# Altium schematic sheet top.schdoc: MWH618
size A4; Date: 10.01.2026; CheckedBy: BCY; DrawnBy: miaow; Revision: v1.0.0; SheetNumber: 2; SheetTotal: 17; BoardType: MAIN_PCB; Desc: the top level sch
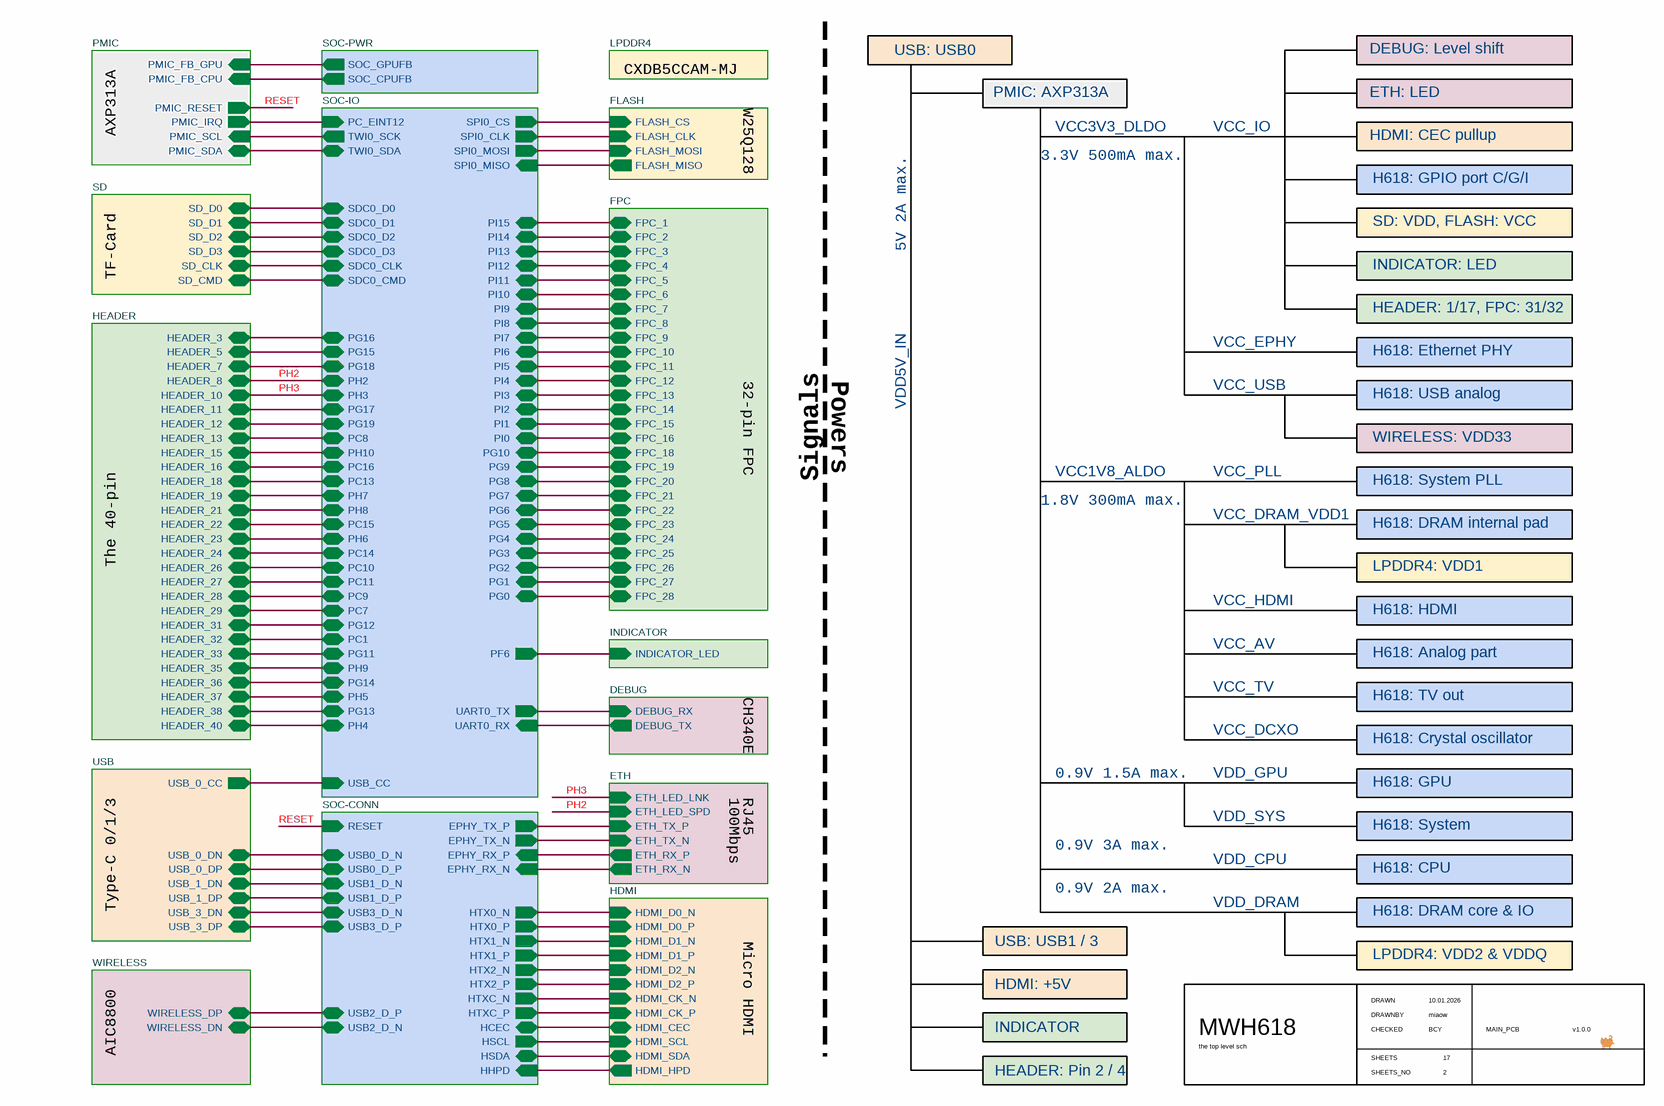
[diagram p0: top.schdoc]

## Sub-sheets
DEBUG = debug.schdoc: DEBUG_TX (out), DEBUG_RX (in)
ETH = eth.schdoc: ETH_TX_P (in), ETH_TX_N (in), ETH_RX_N (out), ETH_RX_P (out), ETH_LED_SPD (in), ETH_LED_LNK (in)
FLASH = flash.schdoc: FLASH_CS (in), FLASH_MISO (out), FLASH_MOSI (in), FLASH_CLK (in)
FPC = fpc.schdoc: FPC_4 (bidir), FPC_5 (bidir), FPC_6 (bidir), FPC_7 (bidir), FPC_8 (bidir), FPC_9 (bidir), FPC_10 (bidir), FPC_11 (bidir), FPC_12 (bidir), FPC_13 (bidir), FPC_14 (bidir), FPC_15 (bidir), FPC_16 (bidir), FPC_22 (bidir), FPC_23 (bidir), FPC_24 (bidir), FPC_25 (bidir), FPC_26 (bidir), FPC_27 (bidir), FPC_28 (bidir), FPC_1 (bidir), FPC_3 (bidir), FPC_2 (bidir), FPC_18 (bidir), FPC_19 (bidir), FPC_20 (bidir), FPC_21 (bidir)
HDMI = hdmi.schdoc: HDMI_D0_N (in), HDMI_D0_P (in), HDMI_D1_N (in), HDMI_D1_P (in), HDMI_D2_N (in), HDMI_D2_P (in), HDMI_CEC (bidir), HDMI_SCL (in), HDMI_SDA (bidir), HDMI_HPD (out), HDMI_CK_N (in), HDMI_CK_P (in)
HEADER = header.schdoc: HEADER_3 (bidir), HEADER_5 (bidir), HEADER_7 (bidir), HEADER_8 (bidir), HEADER_10 (bidir), HEADER_11 (bidir), HEADER_12 (bidir), HEADER_13 (bidir), HEADER_15 (bidir), HEADER_16 (bidir), HEADER_18 (bidir), HEADER_19 (bidir), HEADER_21 (bidir), HEADER_22 (bidir), HEADER_23 (bidir), HEADER_24 (bidir), HEADER_26 (bidir), HEADER_27 (bidir), HEADER_28 (bidir), HEADER_29 (bidir), HEADER_31 (bidir), HEADER_32 (bidir), HEADER_33 (bidir), HEADER_35 (bidir), HEADER_36 (bidir), HEADER_37 (bidir), HEADER_38 (bidir), HEADER_40 (bidir)
INDICATOR = indicator.schdoc: INDICATOR_LED (in)
LPDDR4 = dram.schdoc: no entries
PMIC = pmic.schdoc: PMIC_FB_GPU (in), PMIC_FB_CPU (in), PMIC_SDA (bidir), PMIC_SCL (in), PMIC_IRQ (out), PMIC_RESET (out)
SD = sd.schdoc: SD_D0 (bidir), SD_D1 (bidir), SD_CLK (bidir), SD_D2 (bidir), SD_D3 (bidir), SD_CMD (bidir)
SOC-CONN = soc-conn.schdoc: HHPD (in), HSDA (bidir), HSCL (out), HCEC (bidir), HTXC_P (out), HTXC_N (out), HTX2_P (out), HTX2_N (out), HTX1_P (out), HTX1_N (out), HTX0_P (out), HTX0_N (out), EPHY_RX_N (in), EPHY_RX_P (in), EPHY_TX_N (out), EPHY_TX_P (out), USB2_D_P (bidir), USB2_D_N (bidir), USB3_D_P (bidir), USB3_D_N (bidir), USB1_D_P (bidir), USB1_D_N (bidir), USB0_D_P (bidir), USB0_D_N (bidir), RESET (in)
SOC-IO = soc-io.schdoc: UART0_RX (in), UART0_TX (out), PC_EINT12 (in), TWI0_SDA (bidir), TWI0_SCK (out), SDC0_D1 (bidir), SDC0_D2 (bidir), SDC0_D0 (bidir), SDC0_D3 (bidir), SDC0_CLK (bidir), SDC0_CMD (bidir), PG16 (bidir), PG15 (bidir), PG18 (bidir), PG17 (bidir), PG19 (bidir), PC8 (bidir), PH10 (bidir), PC16 (bidir), PC13 (bidir), PH7 (bidir), PH8 (bidir), PC15 (bidir), PH6 (bidir), PC14 (bidir), PC10 (bidir), PC11 (bidir), PC9 (bidir), PC7 (bidir), PG12 (bidir), USB_CC (in), PF6 (out), PC1 (bidir), PG11 (bidir), PH9 (bidir), PG14 (bidir), PH5 (bidir), PG13 (bidir), PH4 (bidir), SPI0_CS (out), SPI0_CLK (out), SPI0_MOSI (out), SPI0_MISO (in), PI15 (bidir), PI14 (bidir), PI13 (bidir), PI12 (bidir), PI11 (bidir), PI10 (bidir), PI9 (bidir), PI8 (bidir), PI7 (bidir), PI6 (bidir), PI4 (bidir), PI5 (bidir), PI3 (bidir), PI2 (bidir), PI1 (bidir), PI0 (bidir), PG10 (bidir), PG9 (bidir), PG8 (bidir), PG7 (bidir), PG6 (bidir), PG5 (bidir), PG4 (bidir), PG0 (bidir), PG3 (bidir), PG2 (bidir), PG1 (bidir), PH2 (bidir), PH3 (bidir)
SOC-PWR = soc-pwr.schdoc: SOC_GPUFB (out), SOC_CPUFB (out)
USB = usb.schdoc: USB_0_DN (bidir), USB_0_DP (bidir), USB_1_DN (bidir), USB_1_DP (bidir), USB_3_DN (bidir), USB_3_DP (bidir), USB_0_CC (out)
WIRELESS = wireless.schdoc: WIRELESS_DN (bidir), WIRELESS_DP (bidir)

## Nets
PH2: sheet SOC-IO/PH2, sheet ETH/ETH_LED_SPD, sheet HEADER/HEADER_8
PH3: sheet SOC-IO/PH3, sheet ETH/ETH_LED_LNK, sheet HEADER/HEADER_10
RESET: sheet PMIC/PMIC_RESET, sheet SOC-CONN/RESET
(unnamed): sheet HDMI/HDMI_D0_N, sheet SOC-CONN/HTX0_N
(unnamed): sheet HDMI/HDMI_D0_P, sheet SOC-CONN/HTX0_P
(unnamed): sheet HDMI/HDMI_D1_N, sheet SOC-CONN/HTX1_N
(unnamed): sheet HDMI/HDMI_D1_P, sheet SOC-CONN/HTX1_P
(unnamed): sheet HDMI/HDMI_D2_N, sheet SOC-CONN/HTX2_N
(unnamed): sheet HDMI/HDMI_D2_P, sheet SOC-CONN/HTX2_P
(unnamed): sheet HDMI/HDMI_CEC, sheet SOC-CONN/HCEC
(unnamed): sheet HDMI/HDMI_SCL, sheet SOC-CONN/HSCL
(unnamed): sheet HDMI/HDMI_SDA, sheet SOC-CONN/HSDA
(unnamed): sheet HDMI/HDMI_HPD, sheet SOC-CONN/HHPD
(unnamed): sheet HDMI/HDMI_CK_N, sheet SOC-CONN/HTXC_N
(unnamed): sheet HDMI/HDMI_CK_P, sheet SOC-CONN/HTXC_P
(unnamed): sheet PMIC/PMIC_FB_GPU, sheet SOC-PWR/SOC_GPUFB
(unnamed): sheet PMIC/PMIC_FB_CPU, sheet SOC-PWR/SOC_CPUFB
(unnamed): sheet PMIC/PMIC_SDA, sheet SOC-IO/TWI0_SDA
(unnamed): sheet PMIC/PMIC_SCL, sheet SOC-IO/TWI0_SCK
(unnamed): sheet PMIC/PMIC_IRQ, sheet SOC-IO/PC_EINT12
(unnamed): sheet SOC-CONN/EPHY_RX_N, sheet ETH/ETH_RX_N
(unnamed): sheet SOC-CONN/EPHY_RX_P, sheet ETH/ETH_RX_P
(unnamed): sheet SOC-CONN/EPHY_TX_N, sheet ETH/ETH_TX_N
(unnamed): sheet SOC-CONN/EPHY_TX_P, sheet ETH/ETH_TX_P
(unnamed): sheet SOC-CONN/USB2_D_P, sheet WIRELESS/WIRELESS_DP
(unnamed): sheet SOC-CONN/USB2_D_N, sheet WIRELESS/WIRELESS_DN
(unnamed): sheet SOC-CONN/USB3_D_P, sheet USB/USB_3_DP
(unnamed): sheet SOC-CONN/USB3_D_N, sheet USB/USB_3_DN
(unnamed): sheet SOC-CONN/USB1_D_P, sheet USB/USB_1_DP
(unnamed): sheet SOC-CONN/USB1_D_N, sheet USB/USB_1_DN
(unnamed): sheet SOC-CONN/USB0_D_P, sheet USB/USB_0_DP
(unnamed): sheet SOC-CONN/USB0_D_N, sheet USB/USB_0_DN
(unnamed): sheet USB/USB_0_CC, sheet SOC-IO/USB_CC
(unnamed): sheet SOC-IO/UART0_RX, sheet DEBUG/DEBUG_TX
(unnamed): sheet SOC-IO/UART0_TX, sheet DEBUG/DEBUG_RX
(unnamed): sheet SOC-IO/SDC0_D1, sheet SD/SD_D1
(unnamed): sheet SOC-IO/SDC0_D2, sheet SD/SD_D2
(unnamed): sheet SOC-IO/SDC0_D0, sheet SD/SD_D0
(unnamed): sheet SOC-IO/SDC0_D3, sheet SD/SD_D3
(unnamed): sheet SOC-IO/SDC0_CLK, sheet SD/SD_CLK
(unnamed): sheet SOC-IO/SDC0_CMD, sheet SD/SD_CMD
(unnamed): sheet SOC-IO/PG16, sheet HEADER/HEADER_3
(unnamed): sheet SOC-IO/PG15, sheet HEADER/HEADER_5
(unnamed): sheet SOC-IO/PG18, sheet HEADER/HEADER_7
(unnamed): sheet SOC-IO/PG17, sheet HEADER/HEADER_11
(unnamed): sheet SOC-IO/PG19, sheet HEADER/HEADER_12
(unnamed): sheet SOC-IO/PC8, sheet HEADER/HEADER_13
(unnamed): sheet SOC-IO/PH10, sheet HEADER/HEADER_15
(unnamed): sheet SOC-IO/PC16, sheet HEADER/HEADER_16
(unnamed): sheet SOC-IO/PC13, sheet HEADER/HEADER_18
(unnamed): sheet SOC-IO/PH7, sheet HEADER/HEADER_19
(unnamed): sheet SOC-IO/PH8, sheet HEADER/HEADER_21
(unnamed): sheet SOC-IO/PC15, sheet HEADER/HEADER_22
(unnamed): sheet SOC-IO/PH6, sheet HEADER/HEADER_23
(unnamed): sheet SOC-IO/PC14, sheet HEADER/HEADER_24
(unnamed): sheet SOC-IO/PC10, sheet HEADER/HEADER_26
(unnamed): sheet SOC-IO/PC11, sheet HEADER/HEADER_27
(unnamed): sheet SOC-IO/PC9, sheet HEADER/HEADER_28
(unnamed): sheet SOC-IO/PC7, sheet HEADER/HEADER_29
(unnamed): sheet SOC-IO/PG12, sheet HEADER/HEADER_31
(unnamed): sheet SOC-IO/PF6, sheet INDICATOR/INDICATOR_LED
(unnamed): sheet SOC-IO/PC1, sheet HEADER/HEADER_32
(unnamed): sheet SOC-IO/PG11, sheet HEADER/HEADER_33
(unnamed): sheet SOC-IO/PH9, sheet HEADER/HEADER_35
(unnamed): sheet SOC-IO/PG14, sheet HEADER/HEADER_36
(unnamed): sheet SOC-IO/PH5, sheet HEADER/HEADER_37
(unnamed): sheet SOC-IO/PG13, sheet HEADER/HEADER_38
(unnamed): sheet SOC-IO/PH4, sheet HEADER/HEADER_40
(unnamed): sheet SOC-IO/SPI0_CS, sheet FLASH/FLASH_CS
(unnamed): sheet SOC-IO/SPI0_CLK, sheet FLASH/FLASH_CLK
(unnamed): sheet SOC-IO/SPI0_MOSI, sheet FLASH/FLASH_MOSI
(unnamed): sheet SOC-IO/SPI0_MISO, sheet FLASH/FLASH_MISO
(unnamed): sheet SOC-IO/PI15, sheet FPC/FPC_1
(unnamed): sheet SOC-IO/PI14, sheet FPC/FPC_2
(unnamed): sheet SOC-IO/PI13, sheet FPC/FPC_3
(unnamed): sheet SOC-IO/PI12, sheet FPC/FPC_4
(unnamed): sheet SOC-IO/PI11, sheet FPC/FPC_5
(unnamed): sheet SOC-IO/PI10, sheet FPC/FPC_6
(unnamed): sheet SOC-IO/PI9, sheet FPC/FPC_7
(unnamed): sheet SOC-IO/PI8, sheet FPC/FPC_8
(unnamed): sheet SOC-IO/PI7, sheet FPC/FPC_9
(unnamed): sheet SOC-IO/PI6, sheet FPC/FPC_10
(unnamed): sheet SOC-IO/PI4, sheet FPC/FPC_12
(unnamed): sheet SOC-IO/PI5, sheet FPC/FPC_11
(unnamed): sheet SOC-IO/PI3, sheet FPC/FPC_13
(unnamed): sheet SOC-IO/PI2, sheet FPC/FPC_14
(unnamed): sheet SOC-IO/PI1, sheet FPC/FPC_15
(unnamed): sheet SOC-IO/PI0, sheet FPC/FPC_16
(unnamed): sheet SOC-IO/PG10, sheet FPC/FPC_18
(unnamed): sheet SOC-IO/PG9, sheet FPC/FPC_19
(unnamed): sheet SOC-IO/PG8, sheet FPC/FPC_20
(unnamed): sheet SOC-IO/PG7, sheet FPC/FPC_21
(unnamed): sheet SOC-IO/PG6, sheet FPC/FPC_22
(unnamed): sheet SOC-IO/PG5, sheet FPC/FPC_23
(unnamed): sheet SOC-IO/PG4, sheet FPC/FPC_24
(unnamed): sheet SOC-IO/PG0, sheet FPC/FPC_28
(unnamed): sheet SOC-IO/PG3, sheet FPC/FPC_25
(unnamed): sheet SOC-IO/PG2, sheet FPC/FPC_26
(unnamed): sheet SOC-IO/PG1, sheet FPC/FPC_27

## Notes on the sheet
- CXDB5CCAM-MJ
- W25Q128
- USB: USB0
- PMIC: AXP313A
- ETH: LED
- DEBUG: Level shift
- AXP313A
- 3.3V 500mA max.
- VCC3V3_DLDO
- VCC_IO
- HDMI: CEC pullup
- H618: GPIO port C/G/I
- 5V 2A max.
- SD: VDD, FLASH: VCC
- TF-Card
- INDICATOR: LED
- HEADER: 1/17, FPC: 31/32
- 32-pin FPC
- Powers
- VDD5V_IN
- VCC_EPHY
- VCC_USB
- H618: USB analog
- H618: Ethernet PHY
- Signals
- VCC1V8_ALDO
- VCC_PLL
- WIRELESS: VDD33
- 1.8V 300mA max.
- VCC_DRAM_VDD1
- H618: System PLL
- H618: DRAM internal pad
- The 40-pin
- VCC_HDMI
- H618: HDMI
- LPDDR4: VDD1
- CH340E
- VCC_AV
- VCC_TV
- H618: Analog part
- VCC_DCXO
- H618: TV out
- H618: Crystal oscillator
- 100Mbps
- RJ45
- 0.9V 1.5A max.
- VDD_GPU
- VDD_SYS
- H618: System
- H618: GPU
- Type-C 0/1/3
- 0.9V 3A max.
- 0.9V 2A max.
- VDD_CPU
- VDD_DRAM
- H618: CPU
- Micro HDMI
- USB: USB1 / 3
- H618: DRAM core & IO
- LPDDR4: VDD2 & VDDQ
- AIC8800
- HDMI: +5V
- INDICATOR
- HEADER: Pin 2 / 4
- DRAWN
- CHECKED
- DRAWNBY
- SHEETS
- SHEETS_NO